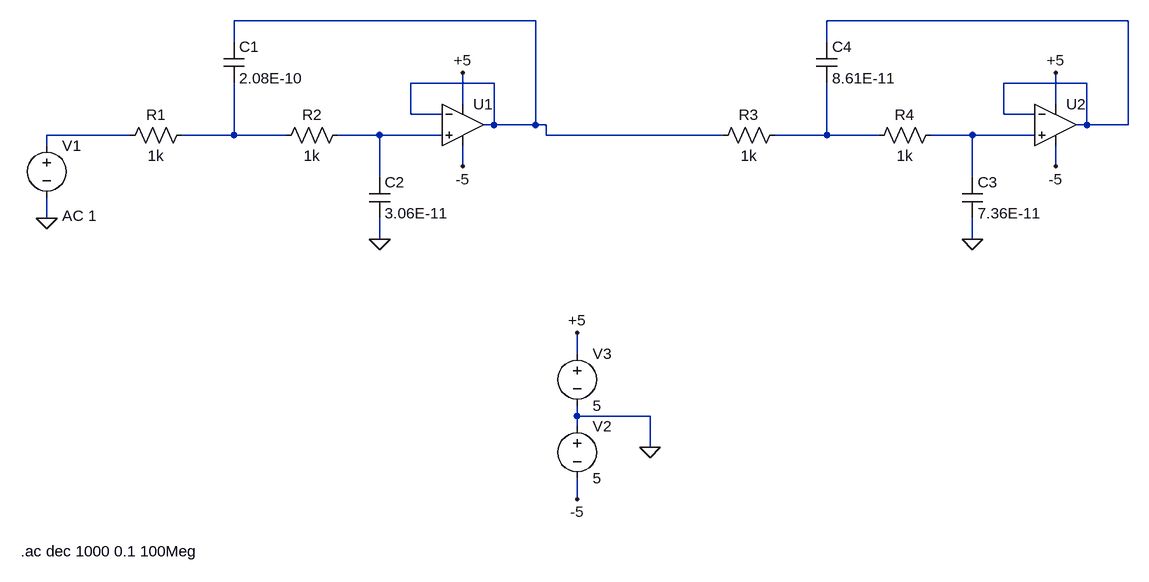
[diagram p0: schematic AntiAliasingFilter.asc]
AntiAliasingFilter.asc, the LTspice schematic file:
Version 4
SHEET 1 1716 752
WIRE 800 -80 336 -80
WIRE 1712 -80 1248 -80
WIRE 336 -48 336 -80
WIRE 1248 -48 1248 -80
WIRE 736 16 608 16
WIRE 1648 16 1520 16
WIRE 688 48 688 0
WIRE 1600 48 1600 0
WIRE 608 64 608 16
WIRE 656 64 608 64
WIRE 1520 64 1520 16
WIRE 1568 64 1520 64
WIRE 736 80 736 16
WIRE 736 80 720 80
WIRE 800 80 800 -80
WIRE 800 80 736 80
WIRE 816 80 800 80
WIRE 1648 80 1648 16
WIRE 1648 80 1632 80
WIRE 1712 80 1712 -80
WIRE 1712 80 1648 80
WIRE 176 96 48 96
WIRE 336 96 336 16
WIRE 336 96 256 96
WIRE 416 96 336 96
WIRE 560 96 496 96
WIRE 656 96 560 96
WIRE 816 96 816 80
WIRE 1088 96 816 96
WIRE 1248 96 1248 16
WIRE 1248 96 1168 96
WIRE 1328 96 1248 96
WIRE 1472 96 1408 96
WIRE 1568 96 1472 96
WIRE 48 112 48 96
WIRE 688 144 688 112
WIRE 1600 144 1600 112
WIRE 560 160 560 96
WIRE 1472 160 1472 96
WIRE 48 224 48 192
WIRE 560 256 560 224
WIRE 1472 256 1472 224
WIRE 864 432 864 400
WIRE 864 528 864 512
WIRE 976 528 864 528
WIRE 864 544 864 528
WIRE 976 576 976 528
WIRE 864 656 864 624
FLAG 864 656 -5
FLAG 864 400 +5
FLAG 976 576 0
FLAG 688 144 -5
FLAG 688 0 +5
FLAG 560 256 0
FLAG 48 224 0
FLAG 1600 144 -5
FLAG 1600 0 +5
FLAG 1472 256 0
SYMBOL voltage 48 96 R0
WINDOW 123 24 124 Left 2
WINDOW 39 0 0 Left 0
SYMATTR Value2 AC 1
SYMATTR InstName V1
SYMATTR Value ""
SYMBOL res 272 80 R90
WINDOW 0 0 56 VBottom 2
WINDOW 3 32 56 VTop 2
SYMATTR InstName R1
SYMATTR Value 1k
SYMBOL res 512 80 R90
WINDOW 0 0 56 VBottom 2
WINDOW 3 32 56 VTop 2
SYMATTR InstName R2
SYMATTR Value 1k
SYMBOL cap 544 160 R0
SYMATTR InstName C2
SYMATTR Value 3.06E-11
SYMBOL cap 320 -48 R0
SYMATTR InstName C1
SYMATTR Value 2.08E-10
SYMBOL OpAmps\\UniversalOpAmp1 688 80 R0
SYMATTR InstName U1
SYMATTR Value2 Avol=100Meg GBW=1000Meg Vos=0
SYMBOL voltage 864 528 R0
WINDOW 123 0 0 Left 0
WINDOW 39 0 0 Left 0
SYMATTR InstName V2
SYMATTR Value 5
SYMBOL voltage 864 416 R0
WINDOW 123 0 0 Left 0
WINDOW 39 0 0 Left 0
SYMATTR InstName V3
SYMATTR Value 5
SYMBOL res 1184 80 R90
WINDOW 0 0 56 VBottom 2
WINDOW 3 32 56 VTop 2
SYMATTR InstName R3
SYMATTR Value 1k
SYMBOL res 1424 80 R90
WINDOW 0 0 56 VBottom 2
WINDOW 3 32 56 VTop 2
SYMATTR InstName R4
SYMATTR Value 1k
SYMBOL cap 1456 160 R0
SYMATTR InstName C3
SYMATTR Value 7.36E-11
SYMBOL cap 1232 -48 R0
SYMATTR InstName C4
SYMATTR Value 8.61E-11
SYMBOL OpAmps\\UniversalOpAmp1 1600 80 R0
SYMATTR InstName U2
SYMATTR Value2 Avol=100Meg GBW=1000Meg Vos=0
TEXT 8 736 Left 2 !.ac dec 1000 0.1 100Meg

The netlist it stands for:
* AntiAliasingFilter.asc
V1 N003 0 AC 1
R1 N004 N003 1k
R2 N005 N004 1k
C2 N005 0 3.06E-11
C1 N001 N004 2.08E-10
XU1 N005 N001 +5 -5 N001 level1 Avol=100Meg GBW=1000Meg Vos=0 En=0 Enk=0 In=0 Ink=0 Rin=500Meg  ; pins In+ In- V+ V- OUT
V2 0 -5 5
V3 +5 0 5
R3 N006 N001 1k
R4 N007 N006 1k
C3 N007 0 7.36E-11
C4 N002 N006 8.61E-11
XU2 N007 N002 +5 -5 N002 level1 Avol=100Meg GBW=1000Meg Vos=0 En=0 Enk=0 In=0 Ink=0 Rin=500Meg  ; pins In+ In- V+ V- OUT
.ac dec 1000 0.1 100Meg
.lib UniversalOpAmp1.lib
.backanno
.end

* Results of the author's LTspice run, read from the files saved beside the schematic
* Operating Point, zero values left out:
*   V(+5) = 5 V
*   V(-5) = -5 V
*   I(V2) = -20 nA
*   I(V3) = -20 nA
*   Ix(u1:3) = 10 nA
*   Ix(u1:4) = -10 nA
*   Ix(u2:3) = 10 nA
*   Ix(u2:4) = -10 nA